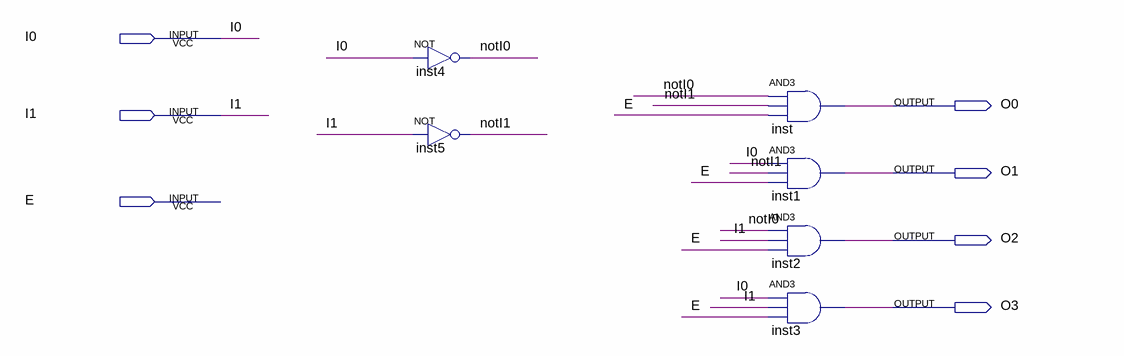
[diagram p0: schematic sheet]
// Quartus schematic DC2_4.bdf as structural Verilog: 6 symbols, 7 pins
module DC2_4 (
  input  I0,
  input  I1,
  input  E,
  output O0,
  output O1,
  output O2,
  output O3
);

  wire notI0, notI1;

  not inst4 (notI0, I0);
  not inst5 (notI1, I1);
  and inst (O0, notI0, notI1, E);
  and inst1 (O1, I0, notI1, E);
  and inst2 (O2, notI0, I1, E);
  and inst3 (O3, I0, I1, E);
endmodule
